# Altium project Chrono_dot.PrjPcb
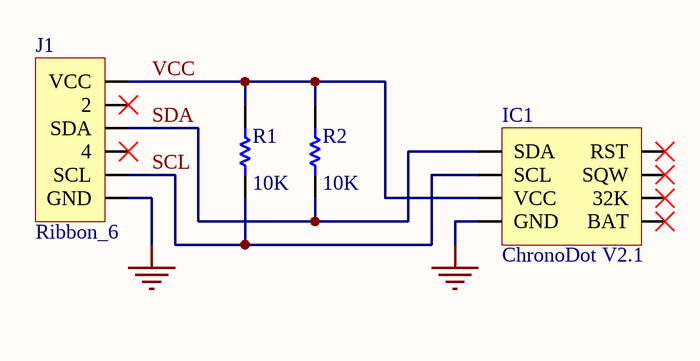
[diagram p0: Chrono_dot.SchDoc]
1 sheet, 4 parts. Net scope: global (net labels, ports and power ports of the same name join across sheets).
Board file: Chrono_dot.PcbDoc

## Sheet Chrono_dot.SchDoc
size A

### Parts
IC1  ChronoDot V2.1  [ChronoDot]
J1  Ribbon_6  [Ribbon62]
R1  value 10K  [0603]  (hidden comment: Res1)
R2  value 10K  [0603]  (hidden comment: Res1)

### Nets
GND: IC1.1(GND) J1.6(GND)
SCL: IC1.3(SCL) J1.5(SCL) R1.1
SDA: IC1.4(SDA) J1.3(SDA) R2.1
VCC: IC1.2(VCC) J1.1(VCC) R1.2 R2.2

Not connected (* = marked no-connect by the designer): IC1 5(BAT)* 6(32K)* 7(SQW)* 8(RST)*; J1 2* 4*

### Library data of the parts
IC1 = ChronoDot V2.1: CHRONODOT - ULTRA-PRECISE RTC
J1 = Ribbon_6: CONN DIP HDR IDC 6POS VERT
R1 R2 = Res1: Resistor; Published: 8-Jun-2000; LatestRevisionDate: 17-Jul-2002; LatestRevisionNote: Re-released for DXP Platform.; PackageReference: AXIAL-0.3; Publisher: Altium Limited; PackageDescription: Axial Device, Thru-Hole; 2 Leads; 0.3 in Pin Spacing